# EAGLE design motadora (EAGLE 8.2.2)
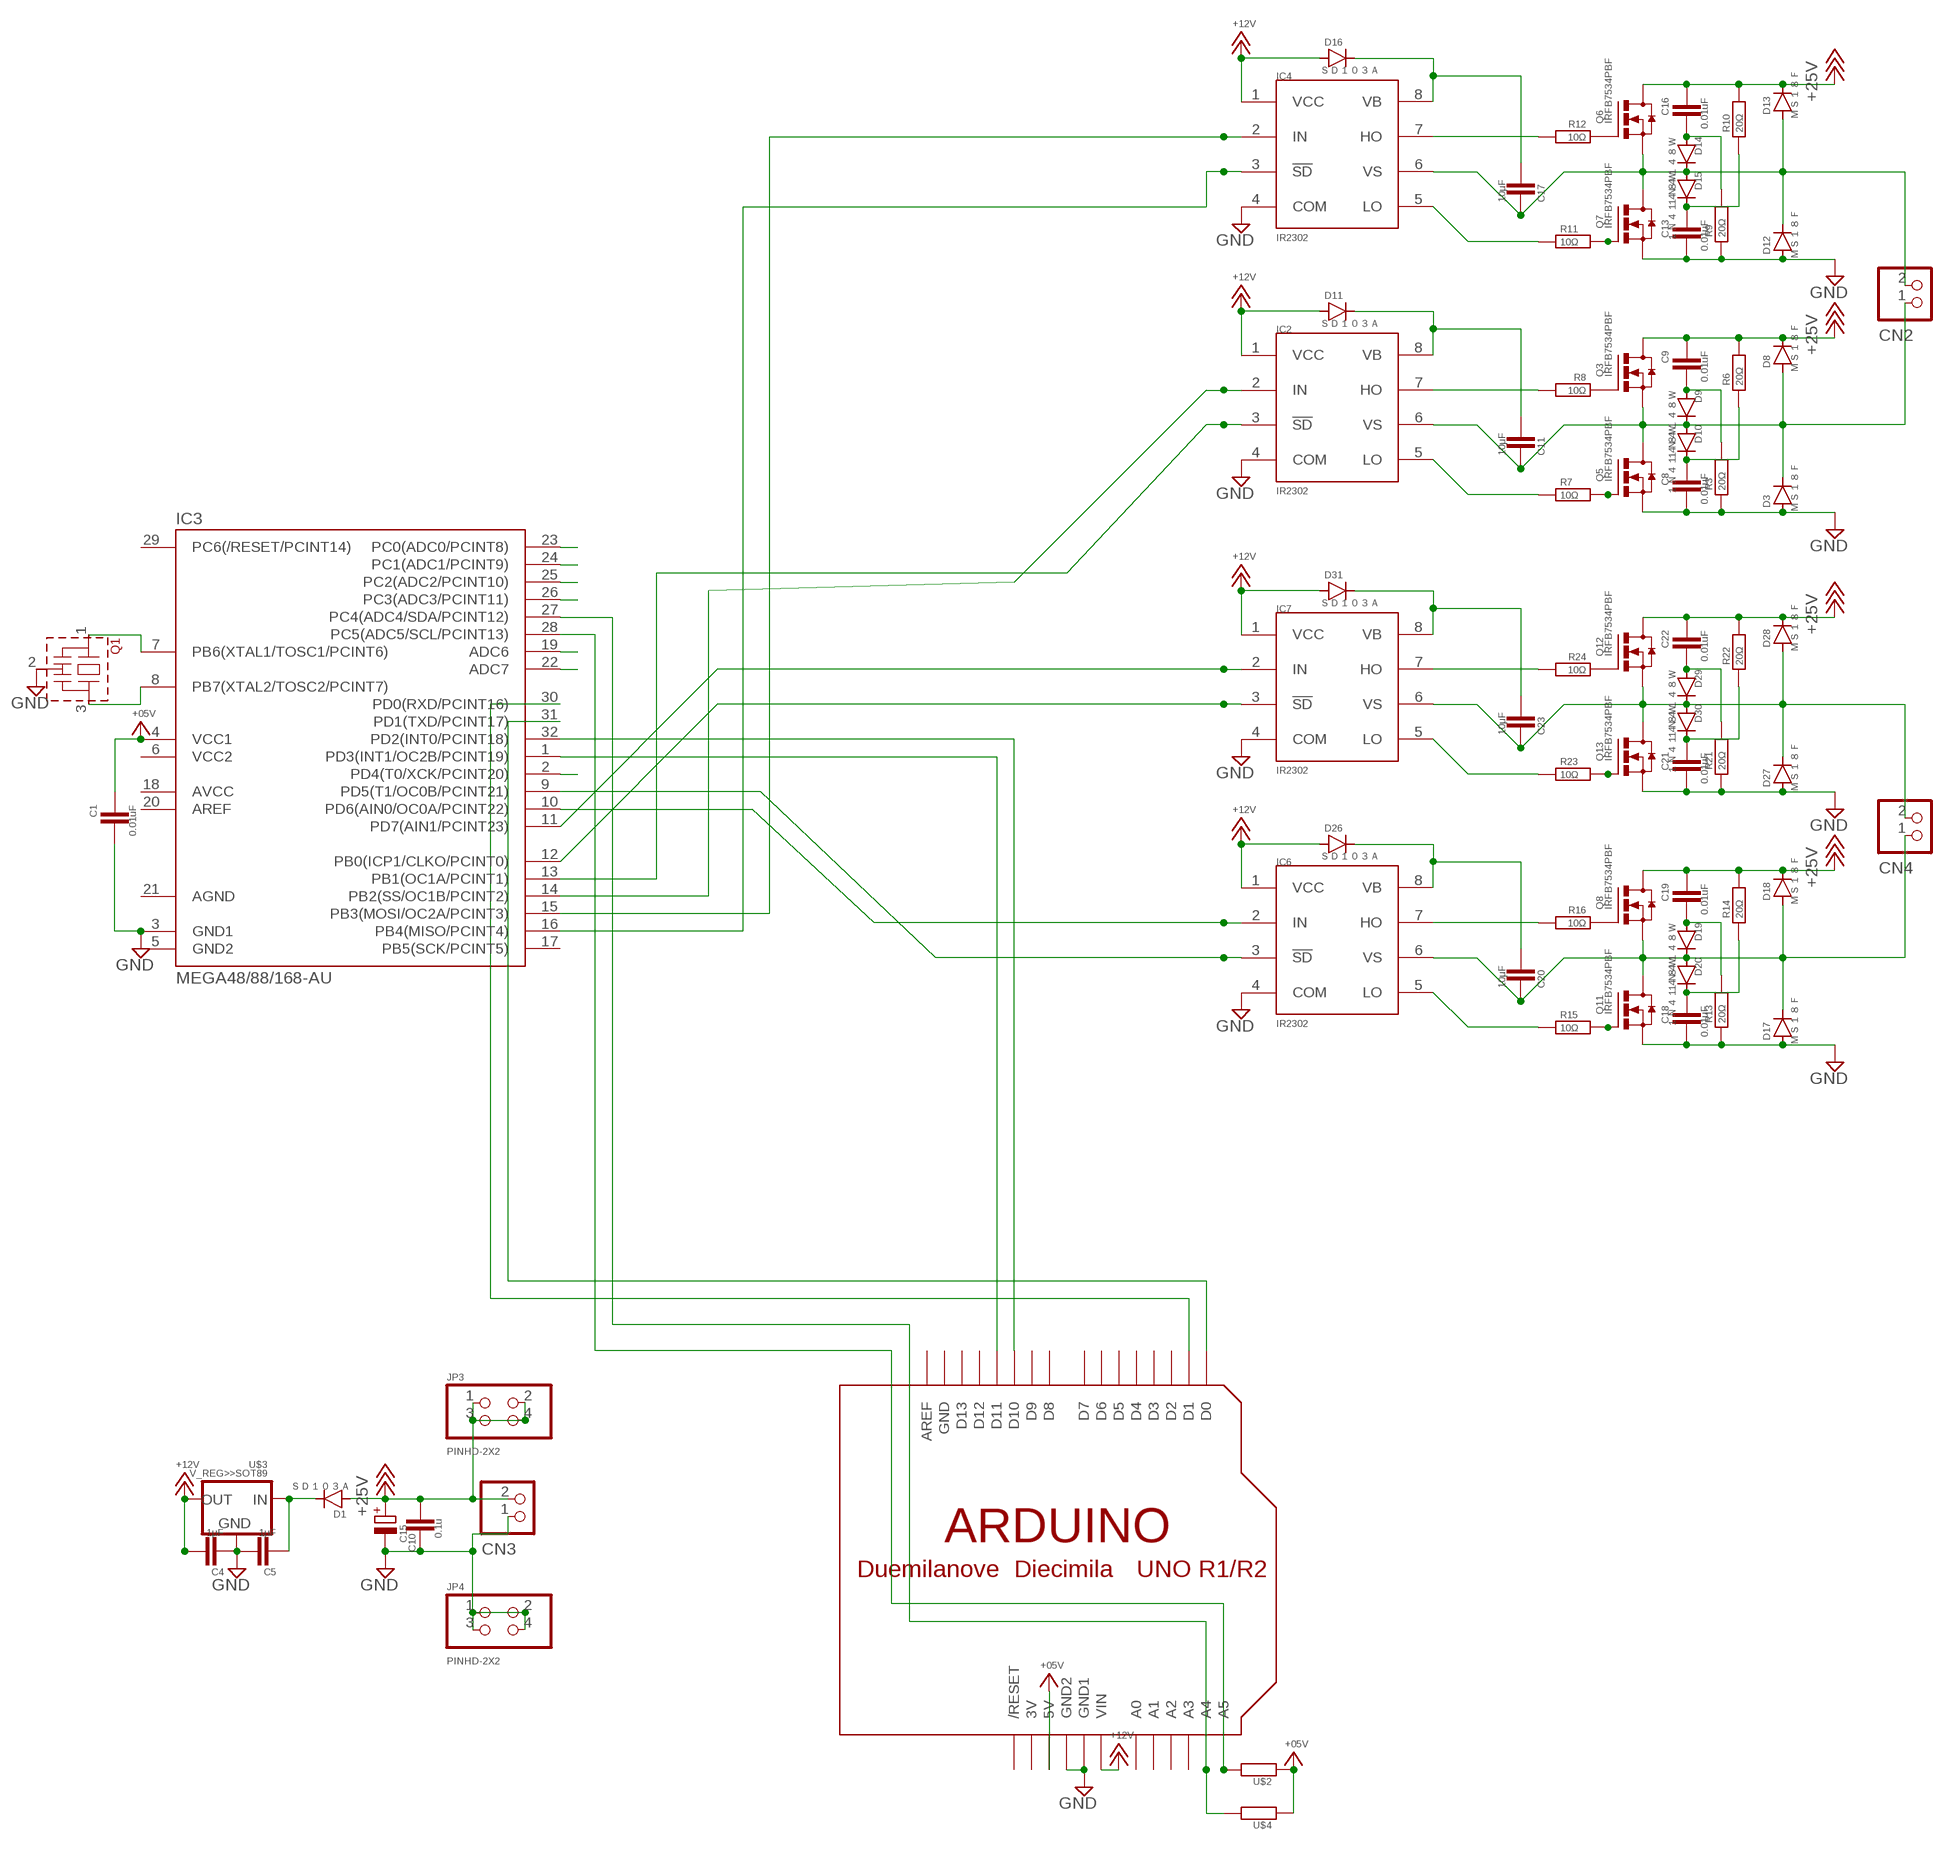
[diagram p0: schematic, sheet 1]

## Parts
C1  0.01uF  CAPACITOR>>2012  [2012]
C4  1μF  CAPACITOR>>2012  [2012]
C5  1μF  CAPACITOR>>2012  [2012]
C8  0.01uF  CAPACITOR>>2012  [2012]
C9  0.01uF  CAPACITOR>>2012  [2012]
C10  0.1u  C-EU025-025X050  [C025-025X050]
C11  10μF  CAPACITOR>>2012  [2012]
C13  0.01uF  CAPACITOR>>2012  [2012]
C15  CPOL-EUTT2D5L  [TT2D5L]
C16  0.01uF  CAPACITOR>>2012  [2012]
C17  10μF  CAPACITOR>>2012  [2012]
C18  0.01uF  CAPACITOR>>2012  [2012]
C19  0.01uF  CAPACITOR>>2012  [2012]
C20  10μF  CAPACITOR>>2012  [2012]
C21  0.01uF  CAPACITOR>>2012  [2012]
C22  0.01uF  CAPACITOR>>2012  [2012]
C23  10μF  CAPACITOR>>2012  [2012]
CN2  S2B-XH-A  [S2B-XH-A]
CN3  S2B-XH-A  [S2B-XH-A]
CN4  S2B-XH-A  [S2B-XH-A]
D1  ＳＤ１０３Ａ  DIODE>>D-7.5  [D-7.5]
D3  ＭＳ１８Ｆ  DIODE>>MS18F  [MS18F]
D8  ＭＳ１８Ｆ  DIODE>>MS18F  [MS18F]
D9  １Ｎ４１４８Ｗ  D-SOD123  [SOD123]
D10  １Ｎ４１４８Ｗ  D-SOD123  [SOD123]
D11  ＳＤ１０３Ａ  DIODE>>SOD123  [SOD123]
D12  ＭＳ１８Ｆ  DIODE>>MS18F  [MS18F]
D13  ＭＳ１８Ｆ  DIODE>>MS18F  [MS18F]
D14  １Ｎ４１４８Ｗ  D-SOD123  [SOD123]
D15  １Ｎ４１４８Ｗ  D-SOD123  [SOD123]
D16  ＳＤ１０３Ａ  DIODE>>SOD123  [SOD123]
D17  ＭＳ１８Ｆ  DIODE>>MS18F  [MS18F]
D18  ＭＳ１８Ｆ  DIODE>>MS18F  [MS18F]
D19  １Ｎ４１４８Ｗ  D-SOD123  [SOD123]
D20  １Ｎ４１４８Ｗ  D-SOD123  [SOD123]
D26  ＳＤ１０３Ａ  DIODE>>SOD123  [SOD123]
D27  ＭＳ１８Ｆ  DIODE>>MS18F  [MS18F]
D28  ＭＳ１８Ｆ  DIODE>>MS18F  [MS18F]
D29  １Ｎ４１４８Ｗ  D-SOD123  [SOD123]
D30  １Ｎ４１４８Ｗ  D-SOD123  [SOD123]
D31  ＳＤ１０３Ａ  DIODE>>SOD123  [SOD123]
IC2  IR2302  IR2302IR2302_  [SO08]
IC3  MEGA48/88/168-AU  [TQFP32-08]
IC4  IR2302  IR2302IR2302_  [SO08]
IC6  IR2302  IR2302IR2302_  [SO08]
IC7  IR2302  IR2302IR2302_  [SO08]
JP3  PINHD-2X2  [2X02]
JP4  PINHD-2X2  [2X02]
Q1  CSTLS_G  [CSTLS_G8]
Q3  IRFB7534PBF  MOS-FET_N(D2PACK)  [D2PACK]
Q5  IRFB7534PBF  MOS-FET_N(D2PACK)  [D2PACK]
Q6  IRFB7534PBF  MOS-FET_N(D2PACK)  [D2PACK]
Q7  IRFB7534PBF  MOS-FET_N(D2PACK)  [D2PACK]
Q8  IRFB7534PBF  MOS-FET_N(D2PACK)  [D2PACK]
Q11  IRFB7534PBF  MOS-FET_N(D2PACK)  [D2PACK]
Q12  IRFB7534PBF  MOS-FET_N(D2PACK)  [D2PACK]
Q13  IRFB7534PBF  MOS-FET_N(D2PACK)  [D2PACK]
R3  20Ω  REGISTER>>2012  [2012]
R6  20Ω  REGISTER>>2012  [2012]
R7  10Ω  REGISTER>>2012  [2012]
R8  10Ω  REGISTER>>2012  [2012]
R9  20Ω  REGISTER>>2012  [2012]
R10  20Ω  REGISTER>>2012  [2012]
R11  10Ω  REGISTER>>2012  [2012]
R12  10Ω  REGISTER>>2012  [2012]
R13  20Ω  REGISTER>>2012  [2012]
R14  20Ω  REGISTER>>2012  [2012]
R15  10Ω  REGISTER>>2012  [2012]
R16  10Ω  REGISTER>>2012  [2012]
R21  20Ω  REGISTER>>2012  [2012]
R22  20Ω  REGISTER>>2012  [2012]
R23  10Ω  REGISTER>>2012  [2012]
R24  10Ω  REGISTER>>2012  [2012]
U$1  ARDUINO-NOHOLE  [ARDUINO-NOHOLE]
U$2  REGISTER>>2012  [2012]
U$3  V_REG>>SOT89  [SOT89]
U$4  REGISTER>>2012  [2012]

## Nets
+5V: C1.2 IC3.4(VCC1) U$1.5V U$2.1 U$4.1 ; supply symbol labelled +05V
+12V: C4.1 D11.A D16.A D26.A D31.A IC2.1(VCC) IC4.1(VCC) IC6.1(VCC) IC7.1(VCC) U$1.VIN U$3.1(OUT)
+18V: C9.2 C10.1 C15.+ C16.2 C19.2 C22.2 CN3.2 D1.A D8.P$2(C) D13.P$2(C) D18.P$2(C) D28.P$2(C) JP3.1 JP3.2 JP3.3 JP3.4 Q3.2(D) Q6.2(D) Q8.2(D) Q12.2(D) R6.2 R10.2 R14.2 R22.2 ; supply symbol labelled +25V
GND: C1.1 C4.2 C5.1 C8.1 C10.2 C13.1 C15.- C18.1 C21.1 CN3.1 D3.P$1(A) D12.P$1(A) D17.P$1(A) D27.P$1(A) IC2.4(COM) IC3.3(GND1) IC4.4(COM) IC6.4(COM) IC7.4(COM) JP4.1 JP4.2 JP4.3 JP4.4 Q1.2(VSS) Q5.3(S) Q7.3(S) Q11.3(S) Q13.3(S) R3.1 R9.1 R13.1 R21.1 U$1.GND1 U$1.GND2 U$3.2(GND) U$3.2.1(GND)
N$1: IC3.23(PC0(ADC0/PCINT8))
N$3: IC3.28(PC5(ADC5/SCL/PCINT13)) U$1.A5 U$2.2
N$5: IC3.24(PC1(ADC1/PCINT9))
N$8: IC3.27(PC4(ADC4/SDA/PCINT12)) U$1.A4 U$4.2
N$9: IC3.8(PB7(XTAL2/TOSC2/PCINT7)) Q1.3
N$10: IC3.31(PD1(TXD/PCINT17)) U$1.D0
N$11: IC3.30(PD0(RXD/PCINT16)) U$1.D1
N$12: IC3.32(PD2(INT0/PCINT18)) U$1.D10
N$13: C5.2 D1.C U$3.3(IN)
N$16: IC3.1(PD3(INT1/OC2B/PCINT19)) U$1.D11
N$18: IC3.7(PB6(XTAL1/TOSC1/PCINT6)) Q1.1
N$24: IC2.2(IN) IC3.14(PB2(SS/OC1B/PCINT2))
N$26: IC2.3(!SD) IC3.13(PB1(OC1A/PCINT1))
N$32: IC3.25(PC2(ADC2/PCINT10))
N$34: C20.2 CN4.1 D17.P$2(C) D18.P$1(A) D19.C D20.A IC6.6(VS) Q8.3(S) Q11.2(D)
N$36: C19.1 D19.A R13.2
N$37: IC3.15(PB3(MOSI/OC2A/PCINT3)) IC4.2(IN)
N$38: C18.2 D20.C R14.1
N$42: IC3.11(PD7(AIN1/PCINT23)) IC7.2(IN)
N$44: Q11.1(G) R15.2
N$45: IC3.12(PB0(ICP1/CLKO/PCINT0)) IC7.3(!SD)
N$47: C11.2 CN2.1 D3.P$2(C) D8.P$1(A) D9.C D10.A IC2.6(VS) Q3.3(S) Q5.2(D)
N$48: C9.1 D9.A R3.2
N$49: C8.2 D10.C R6.1
N$50: IC3.26(PC3(ADC3/PCINT11))
N$51: Q5.1(G) R7.2
N$52: IC2.5(LO) R7.1
N$53: IC2.7(HO) R8.2
N$54: C11.1 D11.C IC2.8(VB)
N$55: IC3.16(PB4(MISO/PCINT4)) IC4.3(!SD)
N$56: IC6.5(LO) R15.1
N$57: Q3.1(G) R8.1
N$58: IC6.7(HO) R16.2
N$59: C17.2 CN2.2 D12.P$2(C) D13.P$1(A) D14.C D15.A IC4.6(VS) Q6.3(S) Q7.2(D)
N$60: IC3.10(PD6(AIN0/OC0A/PCINT22)) IC6.2(IN)
N$61: C16.1 D14.A R9.2
N$62: IC3.9(PD5(T1/OC0B/PCINT21)) IC6.3(!SD)
N$63: IC3.19(ADC6)
N$64: IC3.22(ADC7)
N$65: IC3.2(PD4(T0/XCK/PCINT20))
N$66: C13.2 D15.C R10.1
N$67: Q7.1(G) R11.2
N$68: IC4.5(LO) R11.1
N$69: IC4.7(HO) R12.2
N$70: C17.1 D16.C IC4.8(VB)
N$71: C20.1 D26.C IC6.8(VB)
N$72: Q6.1(G) R12.1
N$74: Q8.1(G) R16.1
N$76: C23.2 CN4.2 D27.P$2(C) D28.P$1(A) D29.C D30.A IC7.6(VS) Q12.3(S) Q13.2(D)
N$77: C22.1 D29.A R21.2
N$78: C21.2 D30.C R22.1
N$79: Q13.1(G) R23.2
N$80: IC7.5(LO) R23.1
N$81: IC7.7(HO) R24.2
N$82: C23.1 D31.C IC7.8(VB)
N$84: Q12.1(G) R24.1
Unconnected: IC3.17(PB5(SCK/PCINT5)) IC3.18(AVCC) IC3.20(AREF) IC3.29(PC6(/RESET/PCINT14)) U$1.A0 U$1.A1 U$1.A2 U$1.A3 U$1.AREF U$1.D2 U$1.D3 U$1.D4 U$1.D5 U$1.D6 U$1.D7 U$1.D8 U$1.D9 U$1.D12 U$1.D13 U$1.RESET(/RESET)

## Power pins joined to a net without a drawn wire
3V: U$1.3V
AGND: IC3.21(AGND)
GND: U$1.GND
GND2: IC3.5(GND2)
VCC2: IC3.6(VCC2)

## Library data of the parts
C1 C4 C5 C8 C9 C11 C13 C16-C23 = !SMD:CAPACITOR>>
C10 = _capasiter:C-EU: CAPACITOR, European symbol
C15 = _Capasiter(ｺﾝﾃﾞﾝｻ):CPOL-EU: POLARIZED CAPACITOR, European symbol
CN2-CN4 = !con-xh:S2B-XH-A: Wire-to-Board 2.5mm pitch side mount connector Source: http://www.jst-mfg.com/product/pdf/jpn/XH.pdf http://www.jst-mfg.com/product/detail.php?series=277
D1 = !diode(ﾀﾞｲｵｰﾄﾞ):DIODE>>: DIODE
D3 D8 D11-D13 D16-D18 D26-D28 D31 = !diode:DIODE>>: DIODE
D9 D10 D14 D15 D19 D20 D29 D30 = _diode2:D-
IC2 IC4 IC6 IC7 = !irs(GateDriver):IR2302
IC3 = !avr:MEGA48/88/168
JP3 JP4 = _pinhead(ﾋﾟﾝﾍｯﾀﾞ):PINHD-2X2: PIN HEADER
Q1 = !murata-resonators(ｾﾗﾛｯｸ):CSTLS_G: Ceramic resonator 2.00 to 10.00 MHz
Q3 Q5-Q8 Q11-Q13 = _FET&transister&v-reg:MOS-FET_N
R3 R6-R16 R21-R24 U$2 U$4 = !SMD:REGISTER>>
U$1 = adafruit:ARDUINO: Arduino Diecimila/Duemilanove Make a shield with ease, this package has all the named pins as well as the two mounting drill holes and an outline of the USB and DC power connector. The outline is on the DIMENSION layer, so if your board house uses it they will cut the outline to match. http://www.ladyada.net/library/pcb/eaglelibrary.html
U$3 = !FET_transister_v-reg:V_REG>>

## Board
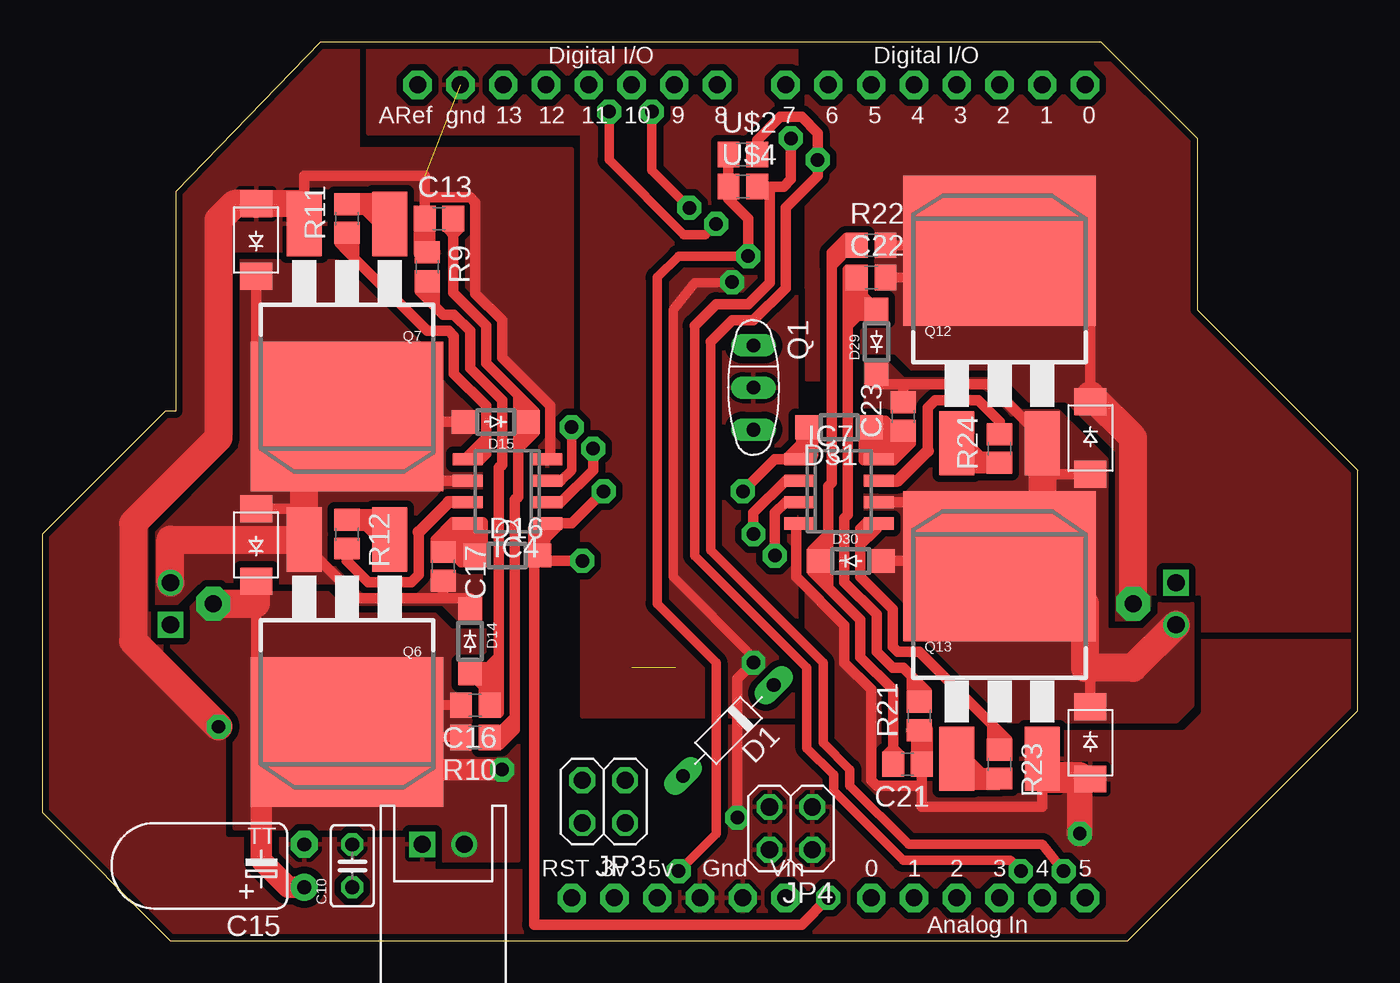
[diagram p1: board, top side]
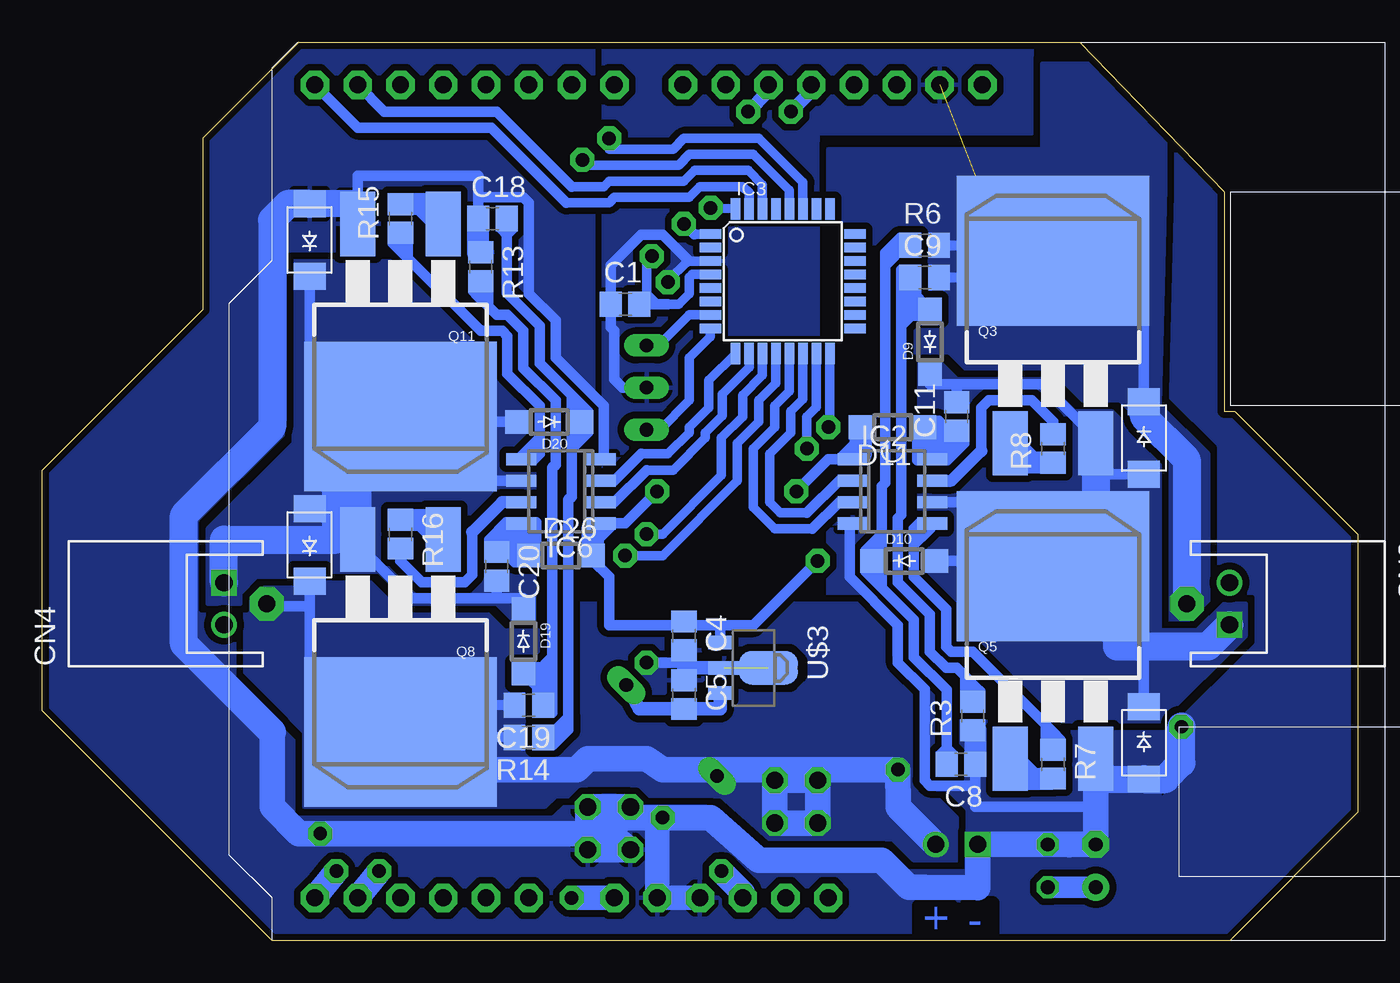
[diagram p2: board, bottom side, seen from below]

Size 78.1 x 53.34 mm. Coordinates in mm from the lower left corner, seen from the top.
Outline: 0,24.13 0,7.62 7.62,0 64.45,0 78.1,13.65 78.1,27.94 68.58,37.46 68.58,47.62 62.87,53.34 16.51,53.34 7.94,44.45 7.94,31.43 7.3,31.43 0,24.13
Copper layers (1*16): Top 0.035mm / dielectric 1.5mm / Bottom 0.035mm
Design rules "default *": minimum track width 10mil, minimum drill 24mil, track to track 8mil, track to pad 8mil, pad to pad 8mil, via to via 8mil, smd to smd 8mil, copper to edge 8mil, drill to drill 8mil, minimum pad ring 10mil, minimum via ring 8mil, stop-mask expansion 4mil, vias tented up to drill 0mil, thermal gap 10mil

### Footprints (pad centres in the part's own frame; a part is rotated, then mirrored left to right if it is on the bottom)
2012 = smd 1.3 x 1.5: 1 -0.85,0; 2 0.85,0
C025-025X050 = drill 0.813 octagon: 1 -1.27,0; 2 1.27,0
TT2D5L = drill 0.813 pad 1.6: + -1.27,0 | drill 0.813 pad 1.6 octagon: - 1.27,0
S2B-XH-A = drill 1.016 square: 1 1.25,0 | drill 1.016: 2 -1.25,0
D-7.5 = drill 0.813 long: A 3.81,0; C -3.81,0
MS18F = smd 1.6 x 1.9: P$1 -2.15,0; P$2 2.15,0
SOD123 = smd 1.4 x 1.4: A 1.905,0; C -1.905,0
SOD123' = smd 1.4 x 1.4: A 1.9,0; C -1.9,0
SO08 = smd 0.72 x 1.78: 1 -1.905,-2.35; 2 -0.635,-2.35; 3 0.635,-2.35; 4 1.905,-2.35; 5 1.905,2.35; 6 0.635,2.35; 7 -0.635,2.35; 8 -1.905,2.35
TQFP32-08 = smd 1.27 x 0.559: 1 -4.293,2.8; 2 -4.293,2; 3 -4.293,1.2; 4 -4.293,0.4; 5 -4.293,-0.4; 6 -4.293,-1.2; 7 -4.293,-2; 8 -4.293,-2.8; 17 4.293,-2.8; 18 4.293,-2; 19 4.293,-1.2; 20 4.293,-0.4; 21 4.293,0.4; 22 4.293,1.2; 23 4.293,2; 24 4.293,2.8 | smd 0.559 x 1.27: 9 -2.8,-4.293; 10 -2,-4.293; 11 -1.2,-4.293; 12 -0.4,-4.293; 13 0.4,-4.293; 14 1.2,-4.293; 15 2,-4.293; 16 2.8,-4.293; 25 2.8,4.293; 26 2,4.293; 27 1.2,4.293; 28 0.4,4.293; 29 -0.4,4.293; 30 -1.2,4.293; 31 -2,4.293; 32 -2.8,4.293
2X02 = drill 1.016 octagon: 1 -1.27,-1.27; 2 -1.27,1.27; 3 1.27,-1.27; 4 1.27,1.27
CSTLS_G8 = drill 0.813 long: 1 -2.5,0; 2 0,0; 3 2.5,0
D2PACK = smd 2.083 x 3.81: 1 -2.54,-9.525; 3 2.54,-9.525 | smd 11.43 x 8.89: 2 0,1.905
ARDUINO-NOHOLE = drill 1 pad 1.676 octagon: 3V 35.56,2.54; 5V 38.1,2.54; A0 50.8,2.54; A1 53.34,2.54; A2 55.88,2.54; A3 58.42,2.54; A4 60.96,2.54; A5 63.5,2.54; AREF 23.876,50.8; D0 63.5,50.8; D1 60.96,50.8; D2 58.42,50.8; D3 55.88,50.8; D4 53.34,50.8; D5 50.8,50.8; D6 48.26,50.8; D7 45.72,50.8; D8 41.656,50.8; D9 39.116,50.8; D10 36.576,50.8; D11 34.036,50.8; D12 31.496,50.8; D13 28.956,50.8; GND 26.416,50.8; GND1 43.18,2.54; GND2 40.64,2.54; RESET 33.02,2.54; VIN 45.72,2.54
SOT89 = smd 0.8 x 1.4: 1 -1.499,-1.981; 3 1.499,-1.981 | smd 0.8 x 1.9: 2 0,-1.727 | smd 2 x 3.5: 2.1 0,0.889

### Placement (x,y rotation side)
C1  43.5,37.78 0 bottom
C4  40,18.1 270 bottom
C5  40,14.6 270 bottom
C8  23.56,10.48 180 bottom
C9  25.72,39.37 0 bottom
C10  18.41,4.45 90 top
C11  23.81,31.11 90 bottom
C13  23.56,42.86 0 top
C15  15.56,4.45 90 top
C16  25.72,13.97 180 top
C17  23.81,22.22 270 top
C18  51.37,42.86 0 bottom
C19  49.21,13.97 180 bottom
C20  51.12,22.22 270 bottom
C21  51.37,10.48 180 top
C22  49.21,39.37 0 top
C23  51.12,31.11 90 top
CN2  7.62,20 270 bottom
CN3  23.81,5.71 180 top
CN4  67.31,20 90 bottom
D1  40.73,12.48 225 top
D3  12.7,11.75 90 bottom
D8  12.7,29.84 90 bottom
D9  25.4,35.56 90 bottom
D10  26.92,22.54 0 bottom
D11  ＳＤ１０３Ａ  [SOD123']  27.62,30.48 180 bottom
D12  12.7,41.59 270 top
D13  12.7,23.49 270 top
D14  25.4,17.78 270 top
D15  26.92,30.8 180 top
D16  ＳＤ１０３Ａ  [SOD123']  27.62,22.86 0 top
D17  62.23,41.59 270 bottom
D18  62.23,23.49 270 bottom
D19  49.53,17.78 270 bottom
D20  48.01,30.8 180 bottom
D26  ＳＤ１０３Ａ  [SOD123']  47.31,22.86 0 bottom
D27  62.23,11.75 90 top
D28  62.23,29.84 90 top
D29  49.53,35.56 90 top
D30  48.01,22.54 0 top
D31  ＳＤ１０３Ａ  [SOD123']  47.31,30.48 180 top
IC2  27.62,26.67 270 bottom
IC3  34.14,39.15 0 bottom
IC4  27.62,26.67 90 top
IC6  47.31,26.67 90 bottom
IC7  47.31,26.67 270 top
JP3  33.34,8.25 180 top
JP4  44.45,6.67 180 top
Q1  42.23,32.83 270 top
Q3  18.1,39.05 0 bottom
Q5  18.1,20.32 0 bottom
Q6  18.1,14.29 180 top
Q7  18.1,33.02 180 top
Q8  56.83,14.29 180 bottom
Q11  56.83,33.02 180 bottom
Q12  56.83,39.05 0 top
Q13  56.83,20.32 0 top
R3  22.86,13.33 90 bottom
R6  25.72,41.27 0 bottom
R7  18.1,10.48 270 bottom
R8  18.1,29.21 90 bottom
R9  22.86,40 270 top
R10  25.72,12.06 180 top
R11  18.1,42.86 90 top
R12  18.1,24.13 270 top
R13  52.07,40 270 bottom
R14  49.21,12.06 180 bottom
R15  56.83,42.86 90 bottom
R16  56.83,24.13 270 bottom
R21  52.07,13.33 90 top
R22  49.21,41.27 0 top
R23  56.83,10.48 270 top
R24  56.83,29.21 90 top
U$1  -1.59,0 0 top
U$2  41.59,46.67 0 top
U$3  35.88,16.19 270 bottom
U$4  41.59,44.77 0 top

### Tracks (layer width: path | path; a pad name or v marks a point on that pad's centre or on a via)
+5V  (via drill 0.8 pad 1.42)
  Top 0.55: v37.78,4.13 40,6.35 40,16.51 36.51,20 36.51,39.37 37.78,40.64 v41.91,40.64
  Top 0.61: U$2.1 U$4.1 40.74,44.03 41.91,42.86 v41.91,40.64
  Bottom 0.55: IC3.4 39.51,39.55 39.69,39.37 39.69,38.42 40.32,37.78 40.96,37.78 41.59,37.78 42.23,38.42 42.23,40.32 v41.91,40.64
  Bottom 0.61: C1.2 40.96,37.78
  Bottom 1.45: U$1.5V 36.51,2.86 v37.78,4.13
+12V  (via drill 0.8 pad 1.42)
  Top 0.61: v46.67,2.54 45.09,0.95 29.21,0.95 29.21,22.54 v32.07,22.54 31.75,22.54 29.52,22.55 D16.A | 29.52,24.45 29.52,24.77 IC4.1 30.8,24.77 | 29.52,23.18 D16.A | v33.34,26.67 31.43,24.77 30.8,24.77 | D16.A 29.52,23.49 30.8,24.77 | 45.41,28.89 45.41,28.57 IC7.1 44.13,28.57 | 45.41,30.16 D31.A 45.41,29.85 44.13,28.57 | v41.59,26.67 43.5,28.57 44.13,28.57
  Top 1.35: 29.52,23.18 29.52,24.45 | 45.41,30.16 45.41,28.89
  Bottom 0.61: 37.86,18.73 35.88,18.73 v32.07,22.54 | U$3.1 37.86,18.73 | 29.52,28.89 29.52,28.57 IC2.1 30.8,28.57 | 29.52,30.16 D11.A 29.52,29.85 30.8,28.57 | v33.34,26.67 31.43,28.57 30.8,28.57 | 45.41,24.45 45.41,24.77 IC6.1 44.13,24.77 | 45.41,23.18 D26.A | v41.59,26.67 43.5,24.77 44.13,24.77 | D26.A 45.41,23.49 44.13,24.77 | D26.A 45.41,22.55 44.45,21.59 44.45,18.73 40.05,18.73 | 40.05,18.73 37.86,18.73 | C4.1 40,18.78 40.05,18.73
  Bottom 1.35: 29.52,30.16 29.52,28.89 | 45.41,23.18 45.41,24.45
  Bottom 1.45: v46.67,2.54 U$1.VIN
+18V  (via drill 0.8 pad 1.42, 1 pad 2)
  Top 0.55: 13.02,10.79 13.02,10.16 15.24,12.38 Q6.2 | 13.02,11.11 13.02,10.48
  Top 0.61: D13.P$2 12.7,20.95 12.7,12.38 Q6.2 | 18.1,12.48 Q6.2 | R10.2 20.72,12.13 18.1,12.17 Q6.2 | Q6.2 18.1,14.07 C16.2 | 18.1,12.7 Q6.2 | D28.P$2 62.23,32.38 62.23,40.96 Q12.2 | 56.83,40.85 Q12.2 | R22.2 56.83,41.17 Q12.2 | Q12.2 56.83,39.27 C22.2 | 56.83,40.64 Q12.2
  Top 1.27: C15.+ 14.6,3.17 13.02,4.76 13.02,10.16 | v27.3,10.16 20.72,10.16 20.72,12.13
  Top 1.676: v10.16,20 12.7,20 12.7,20.95 | v64.77,20 64.77,29.84 62.23,32.38
  Bottom 0.61: 56.2,12.16 56.83,12.17 | D8.P$2 12.7,40.96 Q3.2 | 18.1,40.85 Q3.2 | R6.2 18.1,41.17 Q3.2 | Q3.2 18.1,39.27 C9.2 | 18.1,40.64 Q3.2 | 62.23,19.86 D18.P$2 | 62.23,19.86 62.23,12.38 Q8.2 | 56.83,12.48 Q8.2 | 56.83,12.17 R14.2 | Q8.2 56.83,14.07 C19.2 | 56.83,12.7 Q8.2 | Q8.2 56.83,12.17 | 64.63,19.86 62.23,19.86
  Bottom 0.813: D1.A 40.38,10.16 35.24,10.16
  Bottom 1: JP3.3 32.07,10.11 32.02,10.16 | JP3.1 35.24,10.16
  Bottom 1.27: C15.+ C10.1
  Bottom 1.5: 56.2,12.16 54.29,12.16 54.29,11.75 54.61,11.75 54.61,10.16 46.36,10.16 45.72,10.79 42.23,10.79 41.27,10.16 35.24,10.16 32.02,10.16 v27.3,10.16 27.29,7.92 25.08,5.71 CN3.2 | JP3.4 JP3.2 JP3.1 JP3.3 JP3.4
  Bottom 1.676: v10.16,20 10.16,28.57 12.7,31.11 D8.P$2
  pour Bottom (isolate 0.406, rank 5, no thermals): 31.43,46.99 18.73,46.99 18.73,52.07 11.43,52.07 11.43,44.77 11.75,31.75 8.89,28.89 8.89,18.41 11.75,18.41 11.75,28.57 14.6,31.43 16.83,31.43 18.73,33.34 31.43,33.34
  pour Top (isolate 0.406, rank 5, no thermals): 28.26,4.76 23.81,4.76 23.81,6.67 11.43,6.67 11.43,13.02 6.67,17.78 6.67,21.91 16.83,21.91 18.73,20 28.26,20
  pour Bottom (isolate 0.406, rank 5, no thermals): 56.2,20 26.35,20 26.35,9.84 23.81,7.3 23.81,4.76 26.35,4.76 27.62,6.03 34.92,6.03 37.78,8.57 47.62,8.57 48.26,7.94 62.55,7.94 62.55,12.38 66.04,15.88 66.04,21.59 63.18,21.59 63.18,21.91 58.1,21.91
  pour Top (isolate 0.406, rank 5, no thermals): 45.4,52.07 81.28,52.07 81.28,18.41 63.18,18.41 63.18,28.57 60.33,31.43 58.1,31.43 56.2,33.34 45.4,33.34
GND  (via drill 0.8 pad 1.42)  (2 unrouted)
  Top 0.406: 30.16,29.4 30.1,29.72 | 44.77,23.94 44.83,23.62
  Top 0.55: v42.23,16.51 42.23,16.83 37.47,21.59 37.47,37.46 38.73,39.05 40.04,39.05 v40.96,39.09
  Top 0.61: v42.23,16.51 41.27,15.56 v41.27,7.3 | Q7.3 15.56,45.4 22.71,45.4 22.71,44.13 | C13.1 22.71,44.13 | 22.71,44.13 25.4,44.13 25.72,43.81 25.72,38.42 27.3,36.83 27.3,34.61 30.16,31.75 30.16,29.4 30.16,28.77 IC4.4 | D12.P$1 13.34,43.74 | Q13.3 59.37,9.84 59.37,7.94 52.22,7.94 52.22,9.21 | C21.1 52.22,9.21 | 52.22,9.21 49.53,9.21 49.21,9.52 49.21,14.92 47.62,16.51 47.62,18.73 44.77,21.59 44.77,23.94 44.77,24.57 IC7.4 | D27.P$1 61.59,9.6
  Top 1.3: R9.1 22.71,40.85 C13.1 | R21.1 52.22,12.48 C21.1
  Top 1.5: 59.37,9.84 61.59,9.84 v61.59,6.35
  Top 1.6: 59.37,9.84 59.37,9.6 D27.P$1 | 15.56,43.74 D12.P$1
  Top 1.676: D12.P$1 11.43,43.74 10.48,42.79 10.48,29.84 5.4,24.77 5.4,17.78 v10.48,12.7
  Bottom 0.406: 30.16,23.94 30.1,23.62 | 44.77,29.4 44.83,29.72
  Bottom 0.55: IC3.3 39.78,40.34 40.96,39.16 v40.96,39.09
  Bottom 0.61: Q5.3 15.56,10.16 15.56,7.94 22.71,7.94 22.71,9.21 | C8.1 22.71,9.21 | 22.71,9.21 25.4,9.21 25.72,9.52 25.72,14.92 27.3,16.51 27.3,18.73 30.16,21.59 30.16,23.94 30.16,24.57 IC2.4 | D3.P$1 13.34,9.6 | C18.1 52.22,44.13 | 52.22,44.13 49.53,44.13 49.21,43.81 49.21,38.42 47.62,36.83 47.62,34.61 44.77,31.75 44.77,29.4 44.77,28.77 IC6.4 | 52.22,44.13 52.22,45.4 59.37,45.4 59.37,43.74 Q11.3 | D17.P$1 61.59,43.74 | Q1.2 43.63,32.83 44.13,33.34 44.13,36.19 44.35,36.41 C1.1 44.35,40.11 42.55,41.91 41.27,41.91 39.78,40.41 39.78,40.34 | 40,16.19 40,16.51 v42.23,16.51 | v61.59,6.35 62.87,6.35
  Bottom 0.813: U$3.2 40,16.19 | 40,16.19 C4.2 | C5.1 40,16.19
  Bottom 1.27: C10.2 C15.- | 17.14,5.57 17,5.71
  Bottom 1.3: R3.1 22.71,12.48 C8.1 | R13.1 52.22,40.85 C18.1
  Bottom 1.45: U$1.GND2 U$1.GND1 41.59,7.3 45.4,7.3 JP4.3 | v41.27,7.3 43.5,7.28 45.11,7.3
  Bottom 1.5: JP4.3 JP4.1 JP4.2 JP4.4 44.45,6.35 | 15.56,10.16 C15.- 17,5.71 CN3.1 22.56,3.15 25.72,3.17 26.67,3.17 28.26,4.76 35.56,4.76 38.42,7.3 v41.27,7.3 41.59,7.3 45.11,7.3 JP4.3 | 44.45,6.35 62.87,6.35 64.45,7.94 64.45,12.38 | JP4.3 44.45,6.35
  Bottom 1.6: 15.56,10.16 15.56,9.6 D3.P$1 | 59.37,43.74 D17.P$1
  Bottom 1.676: D3.P$1 11.43,9.6 10.48,10.55 v10.48,12.7 | D17.P$1 63.5,43.74 64.45,42.79 64.45,30.48 69.69,25.24 69.69,17.62 64.45,12.38
  pour Bottom (isolate 0.406, rank 6, no thermals): 29.53,25.08 28.89,25.08 28.89,21.27 20.64,13.02 11.75,13.02 11.75,0 29.84,0
  pour Top (isolate 0.406, rank 6): -3.18,54.61 -3.18,-5.72 84.77,-5.72 84.77,54.61 45.4,54.61 45.4,12.7 31.43,12.7 31.43,46.99 18.73,46.99 18.73,54.61
  pour Bottom (isolate 0.406, rank 6): 32.07,13.33 32.07,47.94 19.37,47.94 19.37,53.34 44.77,53.34 44.77,13.33
  pour Bottom (isolate 0.406, rank 6): -3.18,54.61 -3.18,-5.72 84.77,-5.72 84.77,54.61 45.4,54.61 45.4,12.7 31.43,12.7 31.43,46.99 18.73,46.99 18.73,54.61
  pour Top (isolate 0.406): 19.37,54.61 44.77,54.61 44.77,13.33 32.07,13.33 32.07,47.94 19.37,47.94
N$3  (via drill 0.8 pad 1.42)
  Top 0.55: 39.69,35.56 39.69,23.18 46.36,16.51 46.36,11.75 47.94,10.16 47.94,9.21 51.44,5.71 59.37,5.71 v60.64,4.13
  Top 0.61: 39.69,35.56 40.96,36.83 42.23,36.83 44.13,38.73 44.13,43.5 46.04,45.4 v46.04,46.35 46.04,47.94 45.09,48.89 43.81,48.89 42.44,47.52 U$2.2
  Bottom 0.55: IC3.28 33.74,44.54 35.88,46.67 39.69,46.67 40.32,46.04 46.04,46.04 v46.04,46.35
  Bottom 1.45: v60.64,4.13 U$1.A5
N$8  (via drill 0.8 pad 1.42)
  Top 0.55: 38.73,36.51 38.73,22.86 45.4,16.19 45.4,11.43 46.99,9.84 46.99,8.89 51.12,4.76 57.47,4.76 v58.1,4.13
  Top 0.61: 38.73,36.51 40,37.78 41.91,37.78 43.18,39.05 43.18,44.77 | v44.45,47.62 44.45,45.19 44.03,44.77 43.18,44.77 | 43.18,44.77 U$4.2
  Bottom 0.55: IC3.27 32.94,45.01 35.56,47.62 40,47.62 40.64,46.99 44.45,46.99 v44.45,47.62
  Bottom 1.45: U$1.A4 v58.1,4.13
N$9
  Bottom 0.55: IC3.8 38.44,35.86 39.69,34.61 39.69,32.07 41.42,30.33 Q1.3
N$10
  Bottom 0.55: IC3.31 36.14,44.4 36.51,44.77 39.05,44.77 39.69,44.13 44.13,44.13 44.45,43.81 46.99,43.81
  Bottom 0.61: U$1.D0 59.37,48.26 51.44,48.26 46.99,43.81
N$11
  Bottom 0.55: IC3.30 35.34,44.87 36.2,45.72 39.37,45.72 40,45.08 44.45,45.08 44.77,44.77 46.67,44.77
  Bottom 0.61: U$1.D1 57.78,49.21 51.12,49.21 46.67,44.77
N$12  (via drill 0.8 pad 1.42)
  Top 0.55: v36.2,49.21 36.2,45.72 v38.42,43.5
  Bottom 0.55: IC3.32 38.53,43.5 v38.42,43.5
  Bottom 0.813: U$1.D10 34.99,50.42 v36.2,49.21
N$13
  Bottom 0.813: U$3.3 37.84,13.75 C5.2 | 40.08,13.75 C5.2 | C5.2 42.65,13.75 D1.C
N$16  (via drill 0.8 pad 1.42)
  Top 0.55: v40,42.55 39.37,41.91 38.1,41.91 33.66,46.35 v33.66,49.21
  Bottom 0.55: 38.77,41.94 IC3.1 39.41,41.94
  Bottom 0.61: 39.41,41.94 v40,42.55
  Bottom 0.813: U$1.D11 32.45,50.42 v33.66,49.21
N$18
  Bottom 0.55: IC3.7 39.39,37.15 39.69,37.15 41.59,35.24 42.14,35.24 Q1.1
N$24
  Bottom 0.55: 32.7,25.4 34.29,25.4 34.92,26.03 34.92,28.89 33.66,30.16 33.66,31.43 32.94,32.14 IC3.14
  Bottom 0.61: 32.7,25.4 30.8,27.3 IC2.2
N$26
  Bottom 0.55: 32.38,24.45 34.61,24.45 35.88,25.72 35.88,29.21 34.61,30.48 34.61,31.75 33.74,32.61 IC3.13
  Bottom 0.61: IC2.3 30.8,26.03 32.38,24.45
N$34
  Bottom 0.61: D17.P$2 62.23,31.11 Q11.2 | Q11.2 56.83,31.75 59.37,31.75 59.37,29.84 | 59.37,27.3 59.37,25.64 | 59.37,24.66 Q8.3 59.37,23.49 56.2,20.32 51.12,20.32 | 56.83,30.8 56.83,27.3 IC6.6 | 56.83,30.8 Q11.2 | 51.44,32.32 51.44,32.7 | D18.P$1 59.37,25.64 | 59.37,25.64 59.37,24.69 | D20.A 56.83,30.8 | 51.12,20.32 C20.2 | D19.C 49.53,20.32 51.12,20.32
  Bottom 1.6: 59.37,25.4 59.37,24.69 59.37,24.66 59.37,23.49
  Bottom 1.676: 59.37,29.84 59.37,27.3 59.37,25.72 | CN4.1 67.31,23.81 60.64,23.81 60.64,33.65 60.62,34.61 59.37,34.61 59.37,28.57
  pour Bottom (isolate 0.406, rank 4, no thermals): 63.18,21.91 63.18,21.59 65.41,21.59 66.36,20.64 66.36,20 68.26,20 68.26,24.45 63.18,29.53 63.18,40.32 55.88,40.32 48.89,33.34 48.89,19.05 50.16,19.05 51.12,20 56.2,20 58.1,21.91
N$36
  Bottom 0.61: 48.36,15.88 47.94,15.88 47.94,13.52 47.82,13.52 47.82,16.84 | 47.82,16.84 47.82,28.07 47.62,28.26 47.62,32.07 49.53,33.97 49.53,36.19 50.48,37.15 51.12,37.15 51.62,37.66 | C19.1 48.36,14.71 D19.A 48.78,15.88 47.82,16.84 | R13.2 51.62,38.71 51.62,38.29 | 51.62,38.29 52.26,38.29 | 52.26,38.29 52.51,38.54 | 52.26,38.29 51.62,37.66 | 51.62,37.66 51.62,38.29
  Bottom 1.3: C19.1 48.36,15.88 D19.A
N$37  (via drill 0.8 pad 1.42)
  Top 0.61: v32.7,29.21 32.7,27.94 30.8,26.03 IC4.2
  Bottom 0.55: IC3.15 32.14,31.67 32.7,31.11 v32.7,29.21
N$38
  Bottom 0.61: 48.39,11.62 47.75,11.62 46.86,12.51 46.86,13.27 | D20.C 45.72,30.42 45.72,31.43 48.58,34.29 48.58,36.51 50.52,38.46 50.52,41.91 | 45.85,30.54 D20.C | D20.C 46.1,31.81 46.67,32.38 46.67,26.35 46.86,26.16 46.86,13.27 | 50.52,41.91 C18.2 | 50.52,41.91 50.16,42.27 50.16,43.32 | 50.52,41.91 50.86,42.25 50.86,43.32 | R14.1 48.07,12.06 46.86,13.27 | 46.51,32.23 46.48,32.2 46.48,31.18 D20.C | 46.67,28.57 46.67,29.21 45.72,30.16 | 45.72,30.16 46.36,30.16 | D20.C 46.1,30.54 45.72,30.16 | 46.04,30.8 D20.C
N$42  (via drill 0.8 pad 1.42)
  Top 0.61: v42.23,24.13 42.23,25.4 44.13,27.3 IC7.2
  Bottom 0.55: v42.23,24.13 41.27,24.13 37.78,27.62 37.78,29.84 36.51,31.11 36.51,32.38 35.34,33.55 IC3.11
N$44
  Bottom 0.61: 54.29,42.86 Q11.1 | R15.2 56.09,43.71 53.85,41.47
  Bottom 1.3: R15.2 54.29,43.71 54.29,42.86
N$45  (via drill 0.8 pad 1.42)
  Top 0.61: IC7.3 44.13,26.03 43.5,25.4 v43.5,22.86
  Bottom 0.55: v43.5,22.86 41.27,22.86 36.83,27.3 36.83,29.53 35.56,30.8 35.56,32.07 34.54,33.08 IC3.12
N$47
  Bottom 0.61: D3.P$2 12.7,22.22 Q5.2 | Q5.2 18.1,21.59 15.56,21.59 15.56,23.49 | 15.56,26.03 15.56,27.7 | 15.56,28.68 Q3.3 15.56,29.84 18.73,33.02 23.81,33.02 | 18.1,22.54 18.1,26.03 IC2.6 | 18.1,22.54 Q5.2 | 23.5,21.02 23.5,20.64 | D8.P$1 15.56,27.7 | 15.56,27.7 15.56,28.65 | D10.A 18.1,22.54 | 23.81,33.02 C11.2 | D9.C 25.4,33.02 23.81,33.02
  Bottom 1.6: 15.56,27.94 15.56,28.65 15.56,28.68 15.56,29.84
  Bottom 1.676: 15.56,23.49 15.56,26.03 15.56,27.62 | CN2.1 8.91,17.46 14.29,17.46 14.29,18.73 15.56,18.73 15.56,24.77
  pour Bottom (isolate 0.406, rank 4, no thermals): 11.75,28.57 11.75,18.41 9.52,18.41 7.94,20 6.67,20 6.67,18.1 11.75,13.02 19.05,13.02 26.04,20 26.04,34.29 24.77,34.29 23.81,33.34 18.73,33.34 16.83,31.43 14.6,31.43
N$48
  Bottom 0.61: 26.57,37.46 26.99,37.46 26.99,39.81 27.11,39.81 27.11,36.5 | 27.11,36.5 27.11,25.27 27.3,25.08 27.3,21.27 25.4,19.37 25.4,17.14 24.45,16.19 23.81,16.19 23.3,15.68 | C9.1 26.57,38.63 D9.A 26.15,37.46 27.11,36.5 | R3.2 23.3,14.63 23.3,15.05 | 23.3,15.05 22.67,15.05 | 22.67,15.05 22.41,14.79 | 22.67,15.05 23.3,15.68 | 23.3,15.68 23.3,15.05
  Bottom 1.3: C9.1 26.57,37.46 D9.A
N$49
  Bottom 0.61: 26.54,41.72 27.18,41.72 28.07,40.83 28.07,40.07 | D10.C 29.21,22.92 29.21,21.91 26.35,19.05 26.35,16.83 24.41,14.88 24.41,11.43 | 29.08,22.8 D10.C | D10.C 28.83,21.53 28.26,20.95 28.26,26.99 28.07,27.18 28.07,40.07 | 24.41,11.43 C8.2 | 24.41,11.43 24.77,11.07 24.77,10.02 | 24.41,11.43 24.07,11.09 24.07,10.02 | R6.1 26.86,41.27 28.07,40.07 | 28.42,21.11 28.45,21.15 28.45,22.16 D10.C | 28.26,24.77 28.26,24.13 29.21,23.18 | 29.21,23.18 28.57,23.18 | D10.C 28.83,22.8 29.21,23.18 | 28.89,22.54 D10.C
N$51
  Bottom 0.61: 20.64,10.48 Q5.1 | R7.2 18.84,9.63 21.08,11.88
  Bottom 1.3: R7.2 20.64,9.63 20.64,10.48
N$52
  Bottom 0.61: R7.1 18.1,12.38 | 18.54,12.83 22.86,17.14 24.13,17.14 24.45,17.46 24.45,19.68 26.35,21.59 26.35,24.45 26.04,24.77 | 25.4,24.77 IC2.5 26.04,24.77 | 26.35,23.49 25.56,24.29 | 25.56,24.29 25.08,24.77 24.77,24.77 | 25.56,24.29 26.04,24.29 26.04,24.77 | 18.41,12.7 18.54,12.83 | 18.54,12.7 18.54,12.83 | 18.54,12.7 18.54,10.98 | 18.1,12.38 17.65,11.94 17.65,10.98 | 18.1,12.38 18.41,12.7 | 18.41,12.7 18.54,12.7
N$53
  Bottom 0.61: R8.2 18.1,30.8 19.37,32.07 21.91,32.07 22.35,31.62 22.35,29.08
  Bottom 0.72: IC2.7 24.13,27.3 22.35,29.08
N$54
  Bottom 0.61: 25.78,29.78 25.78,28.51 26.16,28.51 26.16,30.48 | 26.16,30.86 26.16,30.48 | 26.16,30.48 D11.C 24.7,30.48 | 24.38,28.57 IC2.8 24.7,28.57 24.7,30.48 | 24.38,28.57 24.38,28.51 23.37,29.53 23.37,29.84 23.94,29.84 23.94,29.21 24.32,29.21 24.32,29.4 23.81,29.4 C11.1 | C11.1 24.3,30.27 24.64,30.61 | 24.64,30.61 24.89,30.86 25.4,30.86 25.4,28.89 25.08,28.89 25.08,30.8 | 24.7,30.48 23.81,30.48 C11.1 | 24.64,30.61 24.38,30.61 24.38,28.57
N$55  (via drill 0.8 pad 1.42)
  Top 0.55: 30.8,27.3 31.43,27.94 v31.43,30.48
  Top 0.61: IC4.3 30.8,27.3
  Bottom 0.55: IC3.16 31.34,30.57 v31.43,30.48
N$56
  Bottom 0.61: R15.1 56.83,40.96 | 56.39,40.51 52.07,36.19 50.8,36.19 50.48,35.88 50.48,33.65 48.58,31.75 48.58,28.89 48.89,28.57 | 49.53,28.57 IC6.5 48.89,28.57 | 48.58,29.84 49.37,29.05 | 49.37,29.05 49.85,28.57 50.16,28.57 | 49.37,29.05 48.89,29.05 48.89,28.57 | 56.52,40.64 56.39,40.51 | 56.39,40.64 56.39,40.51 | 56.39,40.64 56.39,42.35 | 56.83,40.96 57.28,41.4 57.28,42.35 | 56.83,40.96 56.52,40.64 | 56.52,40.64 56.39,40.64
N$57
  Bottom 0.61: 20.64,29.21 Q3.1 | 19.05,28.36 19.05,28.57 20.32,29.84 20.64,30.16
  Bottom 0.72: Q3.1 20.32,29.84
  Bottom 1.3: R8.1 20.64,28.36 20.64,29.21
N$58
  Bottom 0.61: R16.2 56.83,22.54 55.56,21.27 53.02,21.27 52.58,21.72 52.58,24.26
  Bottom 0.72: IC6.7 50.8,26.03 52.58,24.26
N$59
  Top 0.61: D12.P$2 12.7,31.11 Q7.2 | Q7.2 18.1,31.75 15.56,31.75 15.56,29.84 | 18.1,30.8 18.1,27.3 IC4.6 | 18.1,30.8 Q7.2 | 15.56,23.49 18.73,20.32 23.81,20.32 | 23.5,32.32 23.5,32.7 | D13.P$1 15.56,25.64 15.56,24.69 | D15.A 18.1,30.8 | 23.81,20.32 C17.2 | D14.C 25.4,20.32 23.81,20.32
  Top 1.6: 15.56,25.4 15.56,24.69 Q6.3 15.56,23.49
  Top 1.676: CN2.2 7.62,23.81 Q6.3 15.56,29.84 15.56,34.61
  pour Top (isolate 0.406, rank 4, no thermals): 17.46,21.27 9.21,21.27 7.94,20 6.67,20 6.67,24.13 11.75,29.21 11.75,40.32 19.05,40.32 26.04,33.34 26.04,19.05 24.77,19.05 23.81,20 18.73,20
N$60
  Bottom 0.55: 42.23,27.94 40.64,27.94 38.73,29.84 38.73,30.16 37.73,31.17 37.73,32.44 36.14,34.02 IC3.10
  Bottom 0.61: 42.23,27.94 44.13,26.03 IC6.2
N$61
  Top 0.61: 26.57,15.88 26.99,15.88 26.99,13.52 27.11,13.52 27.11,16.84 | 27.11,16.84 27.11,28.07 27.3,28.26 27.3,32.07 25.4,33.97 25.4,36.19 24.45,37.15 23.81,37.15 23.3,37.66 | C16.1 26.57,14.71 D14.A 26.15,15.88 27.11,16.84 | R9.2 23.3,38.71 23.3,38.29 | 23.3,38.29 22.67,38.29 | 22.67,38.29 22.41,38.54 | 22.67,38.29 23.3,37.66 | 23.3,37.66 23.3,38.29
  Top 1.3: C16.1 26.57,15.88 D14.A
N$62
  Bottom 0.55: 42.55,28.89 40.96,28.89 39.69,30.16 39.69,30.48 38.53,31.64 38.53,33.27 IC3.9
  Bottom 0.61: 42.55,28.89 44.13,27.3 IC6.3
N$66
  Top 0.61: 26.54,11.62 27.18,11.62 28.07,12.51 28.07,13.27 | D15.C 29.21,30.42 29.21,31.43 26.35,34.29 26.35,36.51 24.41,38.46 24.41,41.91 | 29.08,30.54 D15.C | D15.C 28.83,31.81 28.26,32.38 28.26,26.35 28.07,26.16 28.07,13.27 | 24.41,41.91 C13.2 | 24.41,41.91 24.77,42.27 24.77,43.32 | 24.41,41.91 24.07,42.25 24.07,43.32 | R10.1 26.86,12.06 28.07,13.27 | 28.42,32.23 28.45,32.2 28.45,31.18 D15.C | 28.26,28.57 28.26,29.21 29.21,30.16 | 29.21,30.16 28.57,30.16 | D15.C 28.83,30.54 29.21,30.16 | 28.89,30.8 D15.C
N$67
  Top 0.61: 20.64,42.86 Q7.1 | R11.2 18.84,43.71 21.08,41.47
  Top 1.3: R11.2 20.64,43.71 20.64,42.86
N$68
  Top 0.61: R11.1 18.1,40.96 | 18.54,40.51 22.86,36.19 24.13,36.19 24.45,35.88 24.45,33.65 26.35,31.75 26.35,28.89 26.04,28.57 | 25.4,28.57 IC4.5 26.04,28.57 | 26.35,29.84 25.56,29.05 | 25.56,29.05 25.08,28.57 24.77,28.57 | 25.56,29.05 26.04,29.05 26.04,28.57 | 18.41,40.64 18.54,40.51 | 18.54,40.64 18.54,40.51 | 18.54,40.64 18.54,42.35 | 18.1,40.96 17.65,41.4 17.65,42.35 | 18.1,40.96 18.41,40.64 | 18.41,40.64 18.54,40.64
N$69
  Top 0.61: R12.2 18.1,22.54 19.37,21.27 21.91,21.27 22.35,21.72 22.35,24.26
  Top 0.72: IC4.7 24.13,26.03 22.35,24.26
N$70
  Top 0.61: 25.78,23.56 25.78,24.83 26.16,24.83 26.16,22.86 | 26.16,22.48 26.16,22.86 | 26.16,22.86 D16.C 24.7,22.86 | 24.38,24.77 IC4.8 24.7,24.77 24.7,22.86 | 24.38,24.77 24.38,24.83 23.37,23.81 23.37,23.49 23.94,23.49 23.94,24.13 24.32,24.13 24.32,23.94 23.81,23.94 C17.1 | C17.1 24.3,23.07 24.64,22.73 | 24.64,22.73 24.89,22.48 25.4,22.48 25.4,24.45 25.08,24.45 25.08,22.54 | 24.7,22.86 23.81,22.86 C17.1 | 24.64,22.73 24.38,22.73 24.38,24.77
N$71
  Bottom 0.61: 49.15,23.56 49.15,24.83 48.77,24.83 48.77,22.86 | 48.77,22.48 48.77,22.86 | 48.77,22.86 D26.C 50.23,22.86 | 50.55,24.77 IC6.8 50.23,24.77 50.23,22.86 | 50.55,24.77 50.55,24.83 51.56,23.81 51.56,23.49 50.99,23.49 50.99,24.13 50.61,24.13 50.61,23.94 51.12,23.94 C20.1 | C20.1 50.63,23.07 50.29,22.73 | 50.29,22.73 50.04,22.48 49.53,22.48 49.53,24.45 49.85,24.45 49.85,22.54 | 50.23,22.86 51.12,22.86 C20.1 | 50.29,22.73 50.55,22.73 50.55,24.77
N$72
  Top 0.61: 20.64,24.13 Q6.1 | 19.05,24.98 19.05,24.77 20.32,23.49 20.64,23.18
  Top 0.72: Q6.1 20.32,23.49
  Top 1.3: R12.1 20.64,24.98 20.64,24.13
N$74
  Bottom 0.61: 54.29,24.13 Q8.1 | 55.88,24.98 55.88,24.77 54.61,23.49 54.29,23.18
  Bottom 0.72: Q8.1 54.61,23.49
  Bottom 1.3: R16.1 54.29,24.98 54.29,24.13
N$76
  Top 0.61: D27.P$2 62.23,22.22 Q13.2 | Q13.2 56.83,21.59 59.37,21.59 59.37,23.49 | 59.37,26.03 59.37,27.7 | 59.37,28.68 Q12.3 59.37,29.84 56.2,33.02 51.12,33.02 | 56.83,22.54 56.83,26.03 IC7.6 | 56.83,22.54 Q13.2 | 51.44,21.02 51.44,20.64 | D28.P$1 59.37,27.7 | 59.37,27.7 59.37,28.65 | D30.A 56.83,22.54 | 51.12,33.02 C23.2 | D29.C 49.53,33.02 51.12,33.02
  Top 1.6: 59.37,27.94 59.37,28.65 59.37,28.68 59.37,29.84
  Top 1.676: 59.37,23.49 59.37,26.03 59.37,27.62 | CN4.2 64.75,16.19 61.91,16.19 61.91,20 60.62,20 60.62,18.73 59.37,18.73 59.37,24.77
  pour Top (isolate 0.406, rank 4, no thermals): 63.18,28.57 63.18,18.41 65.41,18.41 66.36,19.37 66.36,20 68.26,20 68.26,13.97 67.31,13.02 55.88,13.02 48.89,20 48.89,34.29 50.16,34.29 51.12,33.34 56.2,33.34 58.1,31.43 60.33,31.43
N$77
  Top 0.61: 48.36,37.46 47.94,37.46 47.94,39.81 47.82,39.81 47.82,36.5 | 47.82,36.5 47.82,25.27 47.62,25.08 47.62,21.27 49.53,19.37 49.53,17.14 50.48,16.19 51.12,16.19 51.62,15.68 | C22.1 48.36,38.63 D29.A 48.78,37.46 47.82,36.5 | R21.2 51.62,14.63 51.62,15.05 | 51.62,15.05 52.26,15.05 | 52.26,15.05 52.51,14.79 | 52.26,15.05 51.62,15.68 | 51.62,15.68 51.62,15.05
  Top 1.3: C22.1 48.36,37.46 D29.A
N$78
  Top 0.61: 48.39,41.72 47.75,41.72 46.86,40.83 46.86,40.07 | D30.C 45.72,22.92 45.72,21.91 48.58,19.05 48.58,16.83 50.52,14.88 50.52,11.43 | 45.85,22.8 D30.C | D30.C 46.1,21.53 46.67,20.95 46.67,26.99 46.86,27.18 46.86,40.07 | 50.52,11.43 C21.2 | 50.52,11.43 50.16,11.07 50.16,10.02 | 50.52,11.43 50.86,11.09 50.86,10.02 | R22.1 48.07,41.27 46.86,40.07 | 46.51,21.11 46.48,21.15 46.48,22.16 D30.C | 46.67,24.77 46.67,24.13 45.72,23.18 | 45.72,23.18 46.36,23.18 | D30.C 46.1,22.8 45.72,23.18 | 46.04,22.54 D30.C
N$79
  Top 0.61: 54.29,10.48 Q13.1 | R23.2 56.09,9.63 53.85,11.88
  Top 1.3: R23.2 54.29,9.63 54.29,10.48
N$80
  Top 0.61: R23.1 56.83,12.38 | 56.39,12.83 52.07,17.14 50.8,17.14 50.48,17.46 50.48,19.68 48.58,21.59 48.58,24.45 48.89,24.77 | 49.53,24.77 IC7.5 48.89,24.77 | 48.58,23.49 49.37,24.29 | 49.37,24.29 49.85,24.77 50.16,24.77 | 49.37,24.29 48.89,24.29 48.89,24.77 | 56.52,12.7 56.39,12.83 | 56.39,12.7 56.39,12.83 | 56.39,12.7 56.39,10.98 | 56.83,12.38 57.28,11.94 57.28,10.98 | 56.83,12.38 56.52,12.7 | 56.52,12.7 56.39,12.7
N$81
  Top 0.61: R24.2 56.83,30.8 55.56,32.07 53.02,32.07 52.58,31.62 52.58,29.08
  Top 0.72: IC7.7 50.8,27.3 52.58,29.08
N$82
  Top 0.61: 49.15,29.78 49.15,28.51 48.77,28.51 48.77,30.48 | 48.77,30.86 48.77,30.48 | 48.77,30.48 D31.C 50.23,30.48 | 50.55,28.57 IC7.8 50.23,28.57 50.23,30.48 | 50.55,28.57 50.55,28.51 51.56,29.53 51.56,29.84 50.99,29.84 50.99,29.21 50.61,29.21 50.61,29.4 51.12,29.4 C23.1 | C23.1 50.63,30.27 50.29,30.61 | 50.29,30.61 50.04,30.86 49.53,30.86 49.53,28.89 49.85,28.89 49.85,30.8 | 50.23,30.48 51.12,30.48 C23.1 | 50.29,30.61 50.55,30.61 50.55,28.57
N$84
  Top 0.61: 54.29,29.21 Q12.1 | 55.88,28.36 55.88,28.57 54.61,29.84 54.29,30.16
  Top 0.72: Q12.1 54.61,29.84
  Top 1.3: R24.1 54.29,28.36 54.29,29.21

### Text on the board
Bottom: - | +